# Altium schematic sheet SCH_LIB.SchDoc
size A4
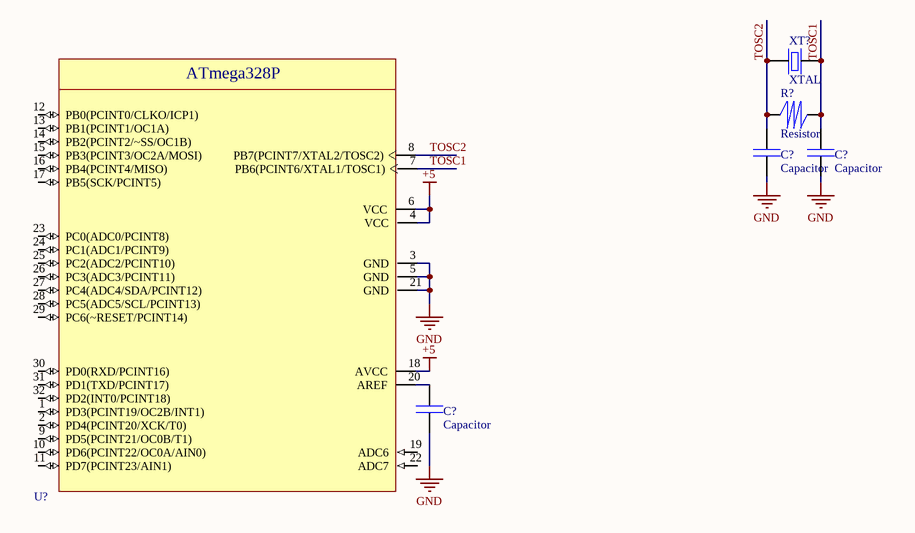
[diagram p0: SCH_LIB.SchDoc]

## Parts
(Parts that share a designator on the sheet are numbered #1, #2 ... from top to bottom, then left to right.)
C?#1  Capacitor
C?#2  Capacitor
C?#3  Capacitor
R?  Resistor
U?  ATmega328P  (value not drawn)
XT?  XTAL

## Nets
+5: U?.4(VCC) U?.6(VCC) U?.18(AVCC)
GND: C?#1.38 C?#2.38 C?#3.38 U?.3(GND) U?.5(GND) U?.21(GND)
TOSC1: C?#2.39 R?.48 U?.7(PB6(PCINT6/XTAL1/TOSC1)) XT?.4
TOSC2: C?#1.39 R?.47 U?.8(PB7(PCINT7/XTAL2/TOSC2)) XT?.5
NetC?#3_39: C?#3.39 U?.20(AREF)

Not connected (* = marked no-connect by the designer): U? 1(PD3(PCINT19/OC2B/INT1)) 2(PD4(PCINT20/XCK/T0)) 9(PD5(PCINT21/OC0B/T1)) 10(PD6(PCINT22/OC0A/AIN0)) 11(PD7(PCINT23/AIN1)) 12(PB0(PCINT0/CLKO/ICP1)) 13(PB1(PCINT1/OC1A)) 14(PB2(PCINT2/~SS/OC1B)) 15(PB3(PCINT3/OC2A/MOSI)) 16(PB4(PCINT4/MISO)) 17(PB5(SCK/PCINT5)) 19(ADC6) 22(ADC7) 23(PC0(ADC0/PCINT8)) 24(PC1(ADC1/PCINT9)) 25(PC2(ADC2/PCINT10)) 26(PC3(ADC3/PCINT11)) 27(PC4(ADC4/SDA/PCINT12)) 28(PC5(ADC5/SCL/PCINT13)) 29(PC6(~RESET/PCINT14)) 30(PD0(RXD/PCINT16)) 31(PD1(TXD/PCINT17)) 32(PD2(INT0/PCINT18))

## Library data of the parts
C?#1-C?#3 = CAPACITOR: 100nF x 50v
U? = ATmega328P_V2: Microcontroller
XT? = XTAL: crystal piezoelectric